# Altium schematic sheet Buttonz.SchDoc
size A4
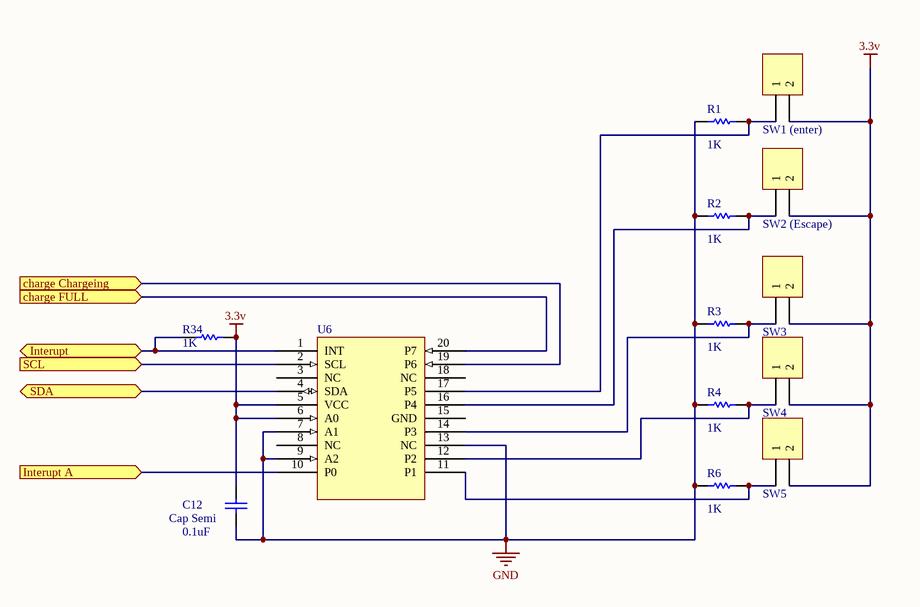
[diagram p0: Buttonz.SchDoc]

## Parts
C12  Cap Semi  value 0.1uF  [C1206]
P40  SW1 (enter)  [HDR1X2]
P41  SW2 (Escape)  [HDR1X2]
P42  SW3  [HDR1X2]
P43  SW4  [HDR1X2]
P44  SW5  [HDR1X2]
R1  value 1K  [0402]  (hidden comment: Res1)
R2  value 1K  [0402]  (hidden comment: Res1)
R3  value 1K  [0402]  (hidden comment: Res1)
R4  value 1K  [0402]  (hidden comment: Res1)
R6  value 1K  [0402]  (hidden comment: Res1)
R34  value 1K  [0402]  (hidden comment: Res1)
U6  Component_1  [SOP20]  (value not drawn)

## Ports
charge Chargeing (in), charge FULL (in), Interupt (bidir), Interupt A (in), SCL (in), SDA (bidir)

## Nets
3.3v: C12.2 P40.2 P41.2 P42.2 P43.2 P44.2 R34.2 U6.5(VCC) U6.6(A0)
GND: C12.1 R1.1 R2.1 R3.1 R4.1 R6.1 U6.7(A1) U6.9(A2) U6.13(NC)
charge Chargeing: U6.19(P6) ; port charge Chargeing
charge FULL: U6.20(P7) ; port charge FULL
Interupt: R34.1 U6.1(INT) ; port Interupt
Interupt A: U6.10(P0) ; port Interupt A
SCL: U6.2(SCL) ; port SCL
SDA: U6.4(SDA) ; port SDA
NetP40_1: P40.1 R1.2 U6.17(P5)
NetP41_1: P41.1 R2.2 U6.16(P4)
NetP42_1: P42.1 R3.2 U6.14(P3)
NetP43_1: P43.1 R4.2 U6.12(P2)
NetP44_1: P44.1 R6.2 U6.11(P1)

Not connected (* = marked no-connect by the designer): U6 3(NC) 8(NC) 15(GND) 18(NC)

## Library data of the parts
C12 = Cap Semi: Capacitor (Semiconductor SIM Model); Published: 8-Jun-2000; LatestRevisionDate: 29-May-2009; LatestRevisionNote: IPC-7351 Footprint Added.; PackageReference: C1206; Publisher: Altium Limited; PackageDescription: Chip Capacitor
P40-P44 = Header 2: Header, 2-Pin; LatestRevisionDate: 17-Jul-2002; LatestRevisionNote: Re-released for DXP Platform.; Publisher: Altium Limited
R1-R4 R6 R34 = Res1: Resistor; Published: 8-Jun-2000; LatestRevisionDate: 17-Jul-2002; LatestRevisionNote: Re-released for DXP Platform.; PackageReference: AXIAL-0.3; Publisher: Altium Limited; PackageDescription: Axial Device, Thru-Hole; 2 Leads; 0.3 in Pin Spacing